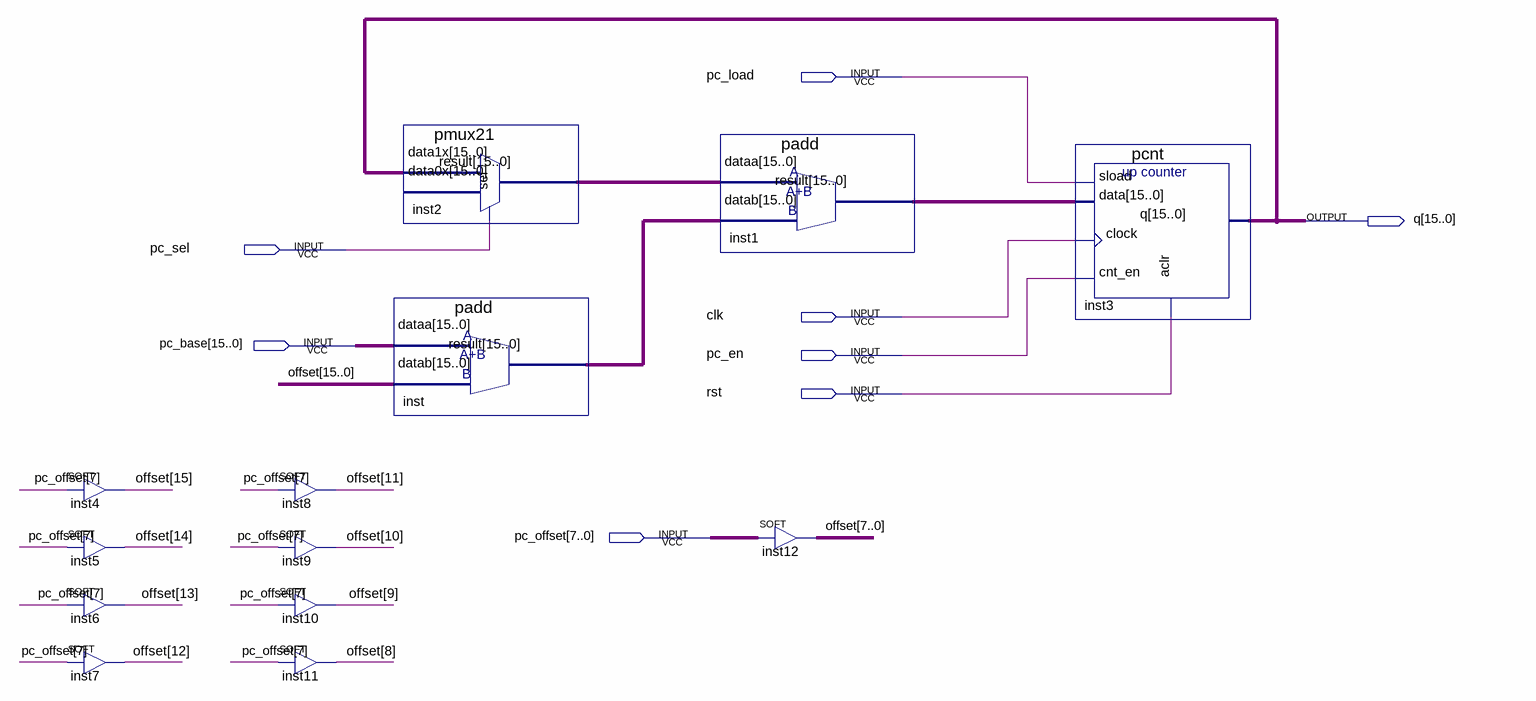
[diagram p0: schematic sheet]
// Quartus schematic pc16.bdf as structural Verilog: 13 symbols, 8 pins
module pc16 (
  input  pc_load,
  input  pc_sel,
  input  clk,
  input  [15:0] pc_base,
  input  pc_en,
  input  rst,
  input  [7:0] pc_offset,
  output [15:0] q
);

  wire [15:0] inst1_result, inst2_result, inst_result, offset;

  SOFT inst4 (.IN(pc_offset[7]), .OUT(offset[15]));
  SOFT inst5 (.IN(pc_offset[7]), .OUT(offset[14]));
  SOFT inst6 (.IN(pc_offset[7]), .OUT(offset[13]));
  SOFT inst7 (.IN(pc_offset[7]), .OUT(offset[12]));
  SOFT inst8 (.IN(pc_offset[7]), .OUT(offset[11]));
  SOFT inst9 (.IN(pc_offset[7]), .OUT(offset[10]));
  SOFT inst10 (.IN(pc_offset[7]), .OUT(offset[9]));
  SOFT inst11 (.IN(pc_offset[7]), .OUT(offset[8]));
  pmux21 inst2 (.data1x(q), .sel(pc_sel), .result(inst2_result));  // open: data0x
  padd inst (.dataa(pc_base), .datab(offset), .result(inst_result));
  padd inst1 (.dataa(inst2_result), .datab(inst_result), .result(inst1_result));
  SOFT inst12[7:0] (.IN(pc_offset), .OUT(offset[7:0]));
  pcnt inst3 (.sload(pc_load), .data(inst1_result), .clock(clk), .cnt_en(pc_en), .aclr(rst), .q(q));
endmodule
